# Altium schematic sheet RS232.SchDoc
size B
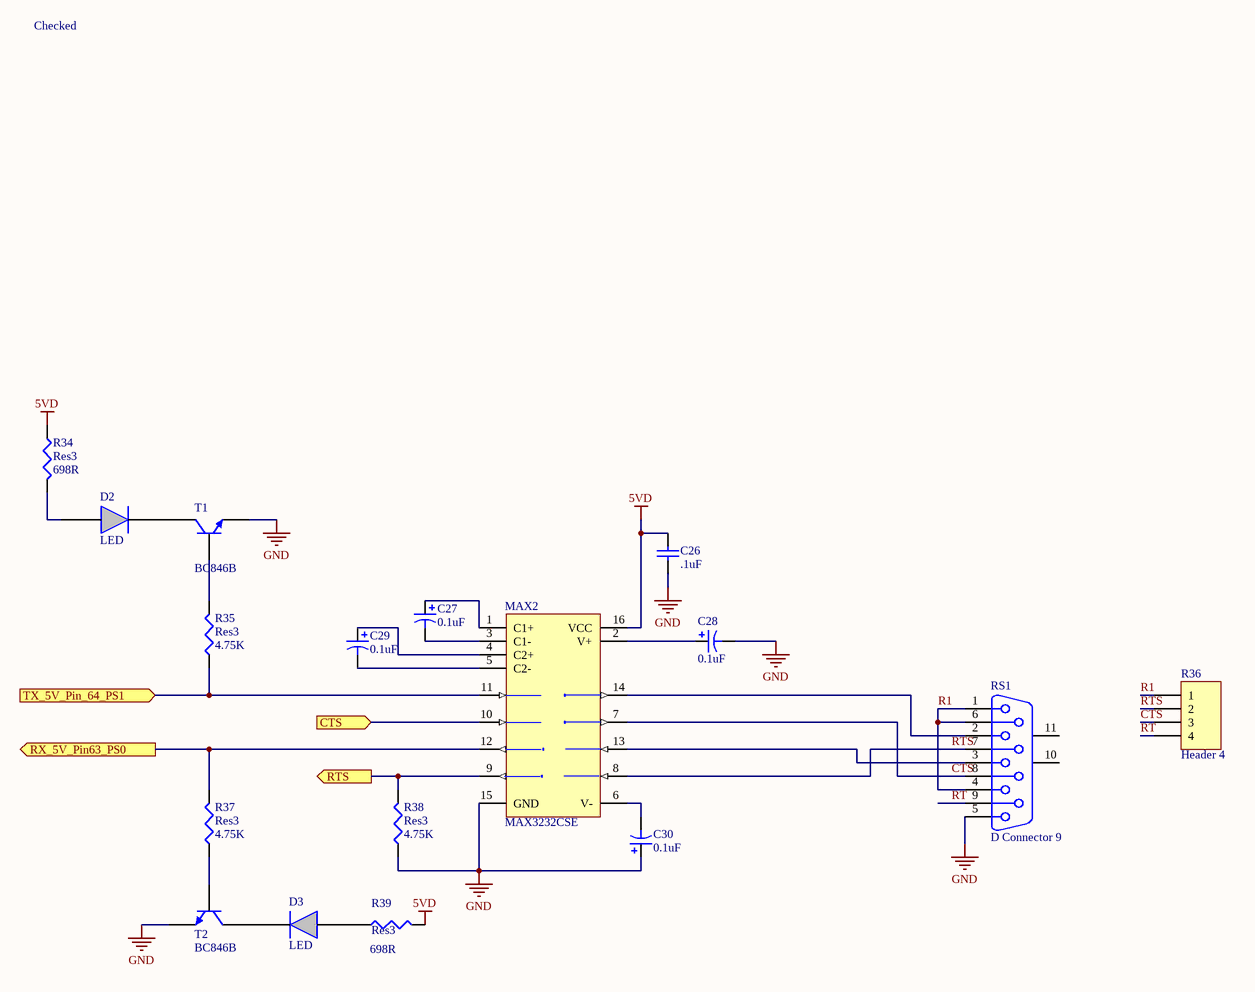
[diagram p0: RS232.SchDoc]

## Parts
C26  value .1uF  [CAPC2012X09M]  (hidden comment: Cap)
C27  value 0.1uF  [CAPACITOR_3MM]  (hidden comment: Pol)
C28  value 0.1uF  [CAPACITOR_3MM]  (hidden comment: Pol)
C29  value 0.1uF  [CAPACITOR_3MM]  (hidden comment: Pol)
C30  value 0.1uF  [CAPACITOR_3MM]  (hidden comment: Pol)
D2  LED  [LED]
D3  LED  [LED]
MAX2  MAX3232CSE  [NSO16_N]
R34  Res3  value 698R  [RESC2112X05M]
R35  Res3  value 4.75K  [RESC2112X05M]
R36  Header 4  [HDR1X4]
R37  Res3  value 4.75K  [RESC2112X05M]
R38  Res3  value 4.75K  [RESC2112X05M]
R39  Res3  value 698R  [RESC2112X05M]
RS1  D Connector 9  [DSUB1.385-2H9]
T1  BC846B  [SOT95P230X110-3M]
T2  BC846B  [SOT95P230X110-3M]

## Ports
CTS (in), RTS (out), RX_5V_Pin63_PS0 (out), TX_5V_Pin_64_PS1 (in)

## Nets
5VD: C26.1 MAX2.16(VCC) R34.1 R39.2
GND: C26.2 C28.2 C30.1 MAX2.15(GND) R38.1 RS1.5 T1.2(E) T2.2(E)
CTS: MAX2.10(T2IN) ; port CTS
CTS: MAX2.7(T2OUT) R36.3 RS1.8  [a separate net that carries the same name]
R1: R36.1 RS1.1 RS1.4 RS1.6
RT: R36.4 RS1.9
RTS: MAX2.8(R2IN) R36.2 RS1.7
RTS: MAX2.9(R2OUT) R38.2 ; port RTS  [a separate net that carries the same name]
RX_5V_Pin63_PS0: MAX2.12(R1OUT) R37.2 ; port RX_5V_Pin63_PS0
TX_5V_Pin_64_PS1: MAX2.11(T1IN) R35.1 ; port TX_5V_Pin_64_PS1
NetC27_1: C27.1 MAX2.1(C1+)
NetC27_2: C27.2 MAX2.3(C1-)
NetC28_1: C28.1 MAX2.2(V+)
NetC29_1: C29.1 MAX2.4(C2+)
NetC29_2: C29.2 MAX2.5(C2-)
NetC30_2: C30.2 MAX2.6(V-)
NetD2_1: D2.1 T1.3(C)
NetD2_2: D2.2 R34.2
NetD3_1: D3.1 T2.3(C)
NetD3_2: D3.2 R39.1
NetMAX2_13: MAX2.13(R1IN) RS1.3
NetMAX2_14: MAX2.14(T1OUT) RS1.2
NetR35_2: R35.2 T1.1(B)
NetR37_1: R37.1 T2.1(B)

Not connected (* = marked no-connect by the designer): RS1 10(MH1) 11(MH2)

## Notes on the sheet
- Checked
- ESE
- is the sole property of ESE. Any reproduction
- The Information Contained in this drawing
- Schematic P/N and Name
- Sheet Name
- 299 Doon Valley Drive
- Kitchener, ON N2G 4M4
- Canada
- Approved
- in part or in whole without the written
- permission of ESE is strictly prohibited.
- APPROVALS
- DATE
- Size
- Scale
- B
- NTS
- Bare PCB P/N
- Date
- Sheet
- Rev.
- Engineer
- of

## Library data of the parts
C26 = CAP-X7R-.1uF-50V-±20%: CAP CER .1uF 50v X7R 0805; MPN: C0805C104M5RACTU; WV: 50; Tolerance: ±20%; PN: 399-1169-1-ND; Name: CAP-X7R-.1uF-50V-±20%; Type: X7R; URL: http://www.digikey.ca/product-detail/en/C0805C104M5RACTU/399-1169-1-ND
C27-C30 = Cap Polar-0.1uF-50V: CAP 85C 0.1uF ±20% 50V WX Series Aluminum Electrolytic; MPN: UWX1H0R1MCL2GB; Tan Theta: 0.12; Leakage Current: 3; Rated Ripple Current: 1; PN: 493-2121-1-ND; Name: Cap Polar-0.1uF-50V; Diameter: 3; URL: http://www.digikey.ca/product-detail/en/UWX1H0R1MCL2GB/493-2121-1-ND
MAX2 = MAX3232CSE: 3.0V TO 5.5V, Low-Power, up to 1Mbps, True RS-232 Transceiver Using Four 0.1µF External Capacitor; PN: MAX3232CSE+-ND; Published: 16-Jan-2001; LatestRevisionDate: 13-Apr-2006; LatestRevisionNote: IPC-7351 Footprint Added.; DatasheetVersion: Mar-1999; PackageReference: NSO16; Publisher: Altium Limited; PackageDescription: 16-Pin Small Outline Integrated Circuit 1.27 mm Pitch; Code_JEDEC: MS-012-AC; Code_IPC: SOIC127P600-16; ComponentLink1Description: Manufacturer Link; ComponentLink1URL: http://www.maxim-ic.com/; ComponentLink2Description: Datasheet; ComponentLink2URL: http://pdfserv.maxim-ic.com/en/ds/MAX3222-MAX3241.pdf; URL: http://www.digikey.ca/product-detail/en/MAX3232CSE%2B/MAX3232CSE%2B-ND/947902
R34 R39 = Resistor_698R: RES SMD 698R OHM 1% 1/8W 0805; MPN: CRCW0805698RFKEA; PN: 541-698CCT-ND; Name: Resistor_698R; URL: http://www.digikey.ca/product-detail/en/CRCW0805698RFKEA/541-698CCT-ND
R35 R37 R38 = Resistor_4.75K: RES SMD 4.75K OHM 1% 1/8W 0805; MPN: CRCW08054K75FKEA; PN: 541-4750KCCT-ND; Name: Resistor_4.75K; URL: http://www.digikey.ca/product-detail/en/CRCW08054K75FKEA/541-4750KCCT-ND
R36 = Header 4: Header, 4-Pin Male; MPN: PEC04SFAN; PN: S1212E-04-ND; URL: http://www.digikey.ca/product-detail/en/PEC04SFAN/S1212E-04-ND
RS1 = D Connector 9: Receptacle Assembly, 9 Position, Right Angle; PN: AE10921-ND; URL: http://www.digikey.ca/product-detail/en/ADF09A-KG-TASB3-R/AE10921-ND/1241800
T1 T2 = BC846B: NPN General Purpose Amplifier; PN: 568-1632-1-ND; URL: http://www.digikey.ca/product-detail/en/BC846B,215/568-1632-1-ND/763459